# Altium schematic sheet TC364_MainBoard_Singal_V1.3.SchDoc
size A4
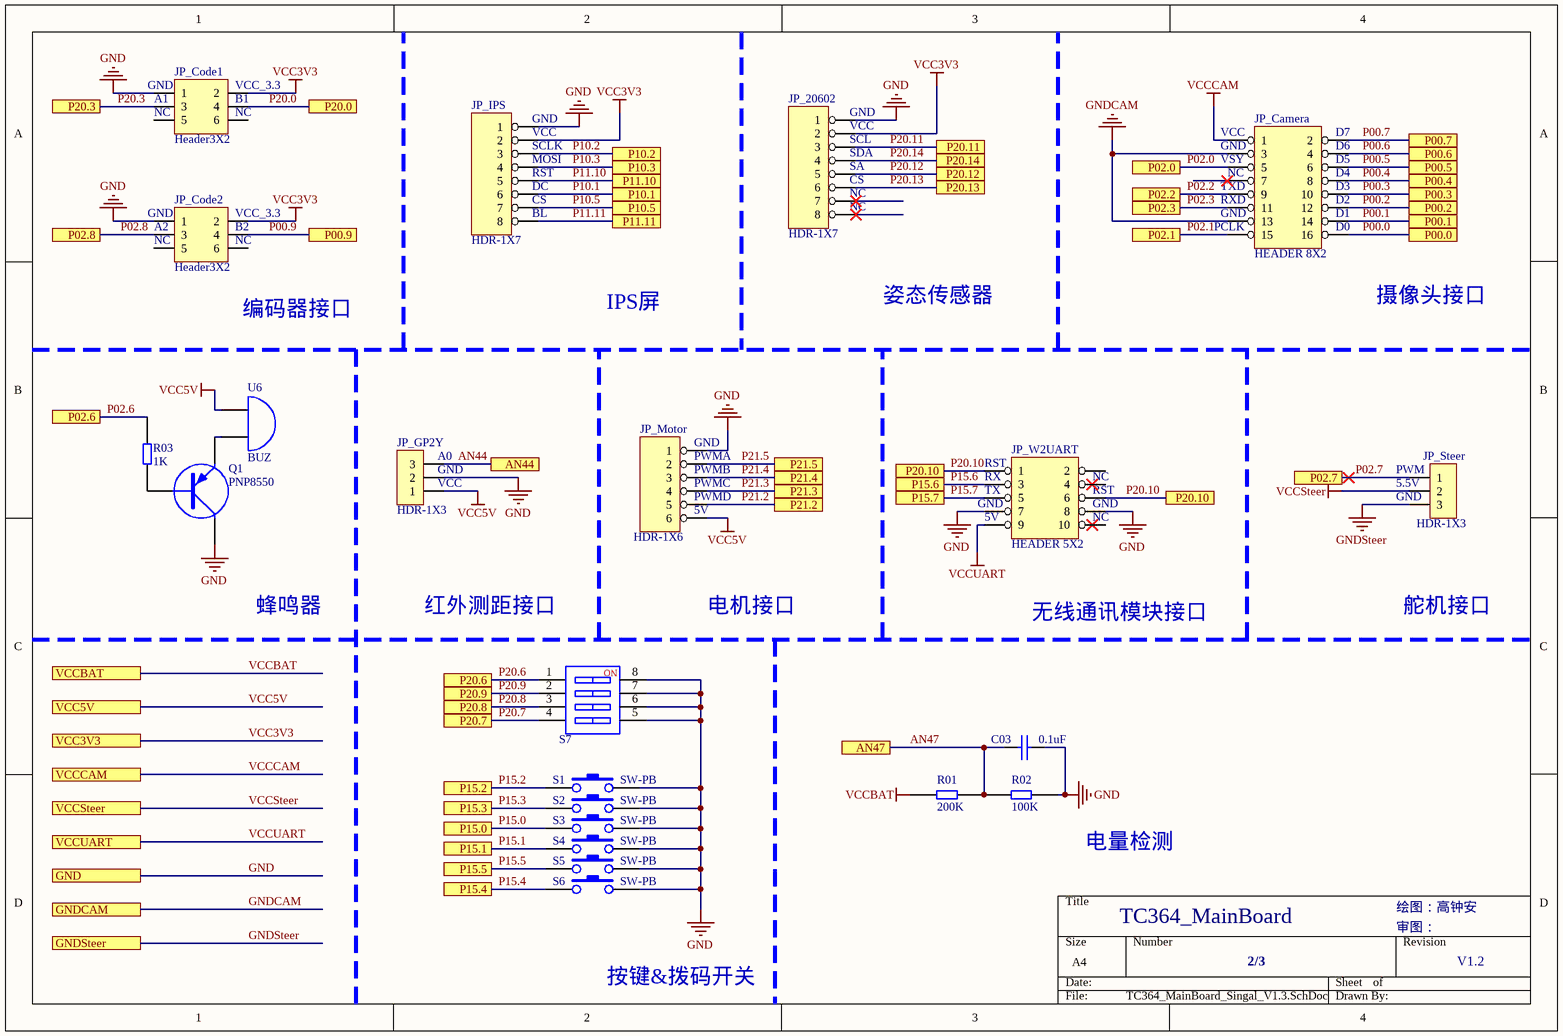
[diagram p0: TC364_MainBoard_Singal_V1.3.SchDoc]

## Parts
C03  0.1uF  [0805C]
JP_20602  HDR-1X7  [SIP8]
JP_Camera  HEADER 8X2  [IDC16-JLC - duplicate]
JP_Code1  Header3X2  [HDR2.54-LI-2x3P]
JP_Code2  Header3X2  [HDR2.54-LI-2x3P]
JP_GP2Y  HDR-1X3  [SIP3N]
JP_IPS  HDR-1X7  [SIP8]
JP_Motor  HDR-1X6  [SIP6N]
JP_Steer  HDR-1X3  [HDR2.54-LI-3P]
JP_W2UART  HEADER 5X2  [IDC10-JLC]
Q1  PNP8550  [PNP8550-SO]
R01  200K  [0805R]
R02  100K  [0805R]
R03  1K  [0805R]
S1  SW-PB  [KEY2-6X3]
S2  SW-PB  [KEY2-6X3]
S3  SW-PB  [KEY2-6X3]
S4  SW-PB  [KEY2-6X3]
S5  SW-PB  [KEY2-6X3]
S6  SW-PB  [KEY2-6X3]
S7  SW-4P  [CSW DIP-4P]  (value not drawn)
U6  BUZ  [BUZ]

## Ports
AN44, AN47, GND, GNDCAM, GNDSteer, P00.0, P00.1, P00.2, P00.3, P00.4, P00.5, P00.6, P00.7, P00.9, P02.0, P02.1, P02.2, P02.3, P02.6, P02.7, P02.8, P10.1, P10.2, P10.3, P10.5, P11.10, P11.11, P15.0, P15.1, P15.2, P15.3, P15.4, P15.5, P15.6, P15.7, P20.0, P20.3, P20.6, P20.7, P20.8, P20.9, P20.10, P20.11, P20.12, P20.13, P20.14, P21.2, P21.3, P21.4, P21.5, VCC3V3, VCC5V, VCCBAT, VCCCAM, VCCSteer, VCCUART

## Nets
GND: C03.2 JP_20602.1 JP_Code1.1 JP_Code2.1 JP_GP2Y.2 JP_IPS.1 JP_Motor.1 JP_W2UART.7 JP_W2UART.8 Q1.3(C) R02.1 S1.2 S2.2 S3.2 S4.2 S5.2 S6.2 S7.5 S7.6 S7.7 S7.8 ; port GND
GNDCAM: JP_Camera.3 JP_Camera.13 ; port GNDCAM
GNDSteer: JP_Steer.3 ; port GNDSteer
VCC3V3: JP_20602.2 JP_Code1.2 JP_Code2.2 JP_IPS.2 ; port VCC3V3
VCC5V: JP_GP2Y.1 JP_Motor.6 U6.1(A) ; port VCC5V
VCCBAT: R01.2 ; port VCCBAT
VCCCAM: JP_Camera.1 ; port VCCCAM
VCCSteer: JP_Steer.2 ; port VCCSteer
VCCUART: JP_W2UART.9 ; port VCCUART
AN44: JP_GP2Y.3 ; port AN44
AN47: C03.1 R01.1 R02.2 ; port AN47
P00.0: JP_Camera.16 ; port P00.0
P00.1: JP_Camera.14 ; port P00.1
P00.2: JP_Camera.12 ; port P00.2
P00.3: JP_Camera.10 ; port P00.3
P00.4: JP_Camera.8 ; port P00.4
P00.5: JP_Camera.6 ; port P00.5
P00.6: JP_Camera.4 ; port P00.6
P00.7: JP_Camera.2 ; port P00.7
P00.9: JP_Code2.4 ; port P00.9
P02.0: JP_Camera.5 ; port P02.0
P02.1: JP_Camera.15 ; port P02.1
P02.2: JP_Camera.9 ; port P02.2
P02.3: JP_Camera.11 ; port P02.3
P02.6: R03.1 ; port P02.6
P02.7: JP_Steer.1 ; port P02.7
P02.8: JP_Code2.3 ; port P02.8
P10.1: JP_IPS.6 ; port P10.1
P10.2: JP_IPS.3 ; port P10.2
P10.3: JP_IPS.4 ; port P10.3
P10.5: JP_IPS.7 ; port P10.5
P11.10: JP_IPS.5 ; port P11.10
P11.11: JP_IPS.8 ; port P11.11
P15.0: S3.1 ; port P15.0
P15.1: S4.1 ; port P15.1
P15.2: S1.1 ; port P15.2
P15.3: S2.1 ; port P15.3
P15.4: S6.1 ; port P15.4
P15.5: S5.1 ; port P15.5
P15.6: JP_W2UART.3 ; port P15.6
P15.7: JP_W2UART.5 ; port P15.7
P20.0: JP_Code1.4 ; port P20.0
P20.3: JP_Code1.3 ; port P20.3
P20.6: S7.1 ; port P20.6
P20.7: S7.4 ; port P20.7
P20.8: S7.3 ; port P20.8
P20.9: S7.2 ; port P20.9
P20.10: JP_W2UART.1 JP_W2UART.6 ; port P20.10
P20.11: JP_20602.3 ; port P20.11
P20.12: JP_20602.5 ; port P20.12
P20.13: JP_20602.6 ; port P20.13
P20.14: JP_20602.4 ; port P20.14
P21.2: JP_Motor.5 ; port P21.2
P21.3: JP_Motor.4 ; port P21.3
P21.4: JP_Motor.3 ; port P21.4
P21.5: JP_Motor.2 ; port P21.5
NetQ1_1: Q1.1(B) R03.2
NetQ1_2: Q1.2(E) U6.2(B)

Not connected (* = marked no-connect by the designer): JP_20602 7* 8*; JP_Camera 7*; JP_Code1 5 6; JP_Code2 5 6; JP_W2UART 2 4 10

## Notes on the sheet
- (near JP_Code1) GND
- (near JP_Code1) A1
- (near JP_Code1) NC
- (near JP_Code1) B1
- (near JP_Code1) VCC_3.3
- (near JP_20602) GND
- (near JP_IPS) VCC
- (near JP_IPS) SCLK
- (near JP_IPS) MOSI
- (near JP_IPS) RST
- (near JP_IPS) GND
- (near JP_20602) VCC
- (near JP_20602) SCL
- (near JP_20602) SDA
- (near JP_20602) SA
- (near JP_Camera) GND
- (near JP_Camera) VSY
- (near JP_Camera) VCC
- (near JP_Camera) NC
- (near JP_Camera) D4
- (near JP_Camera) D5
- (near JP_Camera) D6
- (near JP_Camera) D7
- (near JP_Code2) GND
- (near JP_Code2) A2
- (near JP_Code2) NC
- (near JP_Code2) B2
- (near JP_Code2) VCC_3.3
- (near JP_IPS) DC
- (near JP_IPS) CS
- (near JP_IPS) BL
- (near JP_20602) NC
- (near JP_20602) CS
- (near JP_Camera) PCLK
- (near JP_Camera) TXD
- (near JP_Camera) RXD
- (near JP_Camera) D0
- (near JP_Camera) D1
- (near JP_Camera) D2
- (near JP_Camera) D3
- IPS屏
- 姿态传感器
- 摄像头接口
- (near JP_Code2) 编码器接口
- (near JP_Motor) GND
- (near JP_GP2Y) A0
- (near JP_GP2Y) GND
- (near JP_GP2Y) VCC
- (near JP_Motor) 5V
- (near JP_Motor) PWMA
- (near JP_Motor) PWMB
- (near JP_Motor) PWMC
- (near JP_Motor) PWMD
- (near JP_W2UART) GND
- (near JP_W2UART) TX
- (near JP_W2UART) RX
- (near JP_W2UART) 5V
- (near JP_W2UART) RST
- (near JP_W2UART) NC
- (near JP_Steer) PWM
- (near JP_Steer) GND
- (near JP_Steer) 5.5V
- 蜂鸣器
- 红外测距接口
- 电机接口
- 无线通讯模块接口
- 舵机接口
- 电量检测
- TC364_MainBoard
- 绘图：高钟安
- 按键&拨码开关
- 2/3
- 审图：
- V1.2
- (in symbol SW-4P) NO

## Library data of the parts
C03 = CAP: Capacitor
JP_20602 JP_IPS = HEADER 8: 8 Pin Header
JP_Code1 JP_Code2 = Header 3X2: 3*2P接插件; 版权归属: 封装库来自淘宝 ID：黄晶宝石; BOM名称: 3*2P接插件; 学习资源: https://shop463601444.taobao.com
JP_GP2Y JP_Steer = Header 3: 3P接插件; 版权归属: 封装库来自淘宝 ID：黄晶宝石; BOM名称: 3P接插件; 学习资源: https://shop463601444.taobao.com
JP_Motor = HEADER 6
Q1 = PNP: PNP Transistor
R01 R02 R03 = RES
S1-S6 = SW-PB: 按键
S7 = SW-4P: 4路编码开关; 淘宝ID: 封装库来自淘宝 ID：黄晶宝石; BOM名称: 4路编码开关; 学习资源: https://shop463601444.taobao.com
U6 = BELL